# EAGLE design untitled (EAGLE 7.2.0)
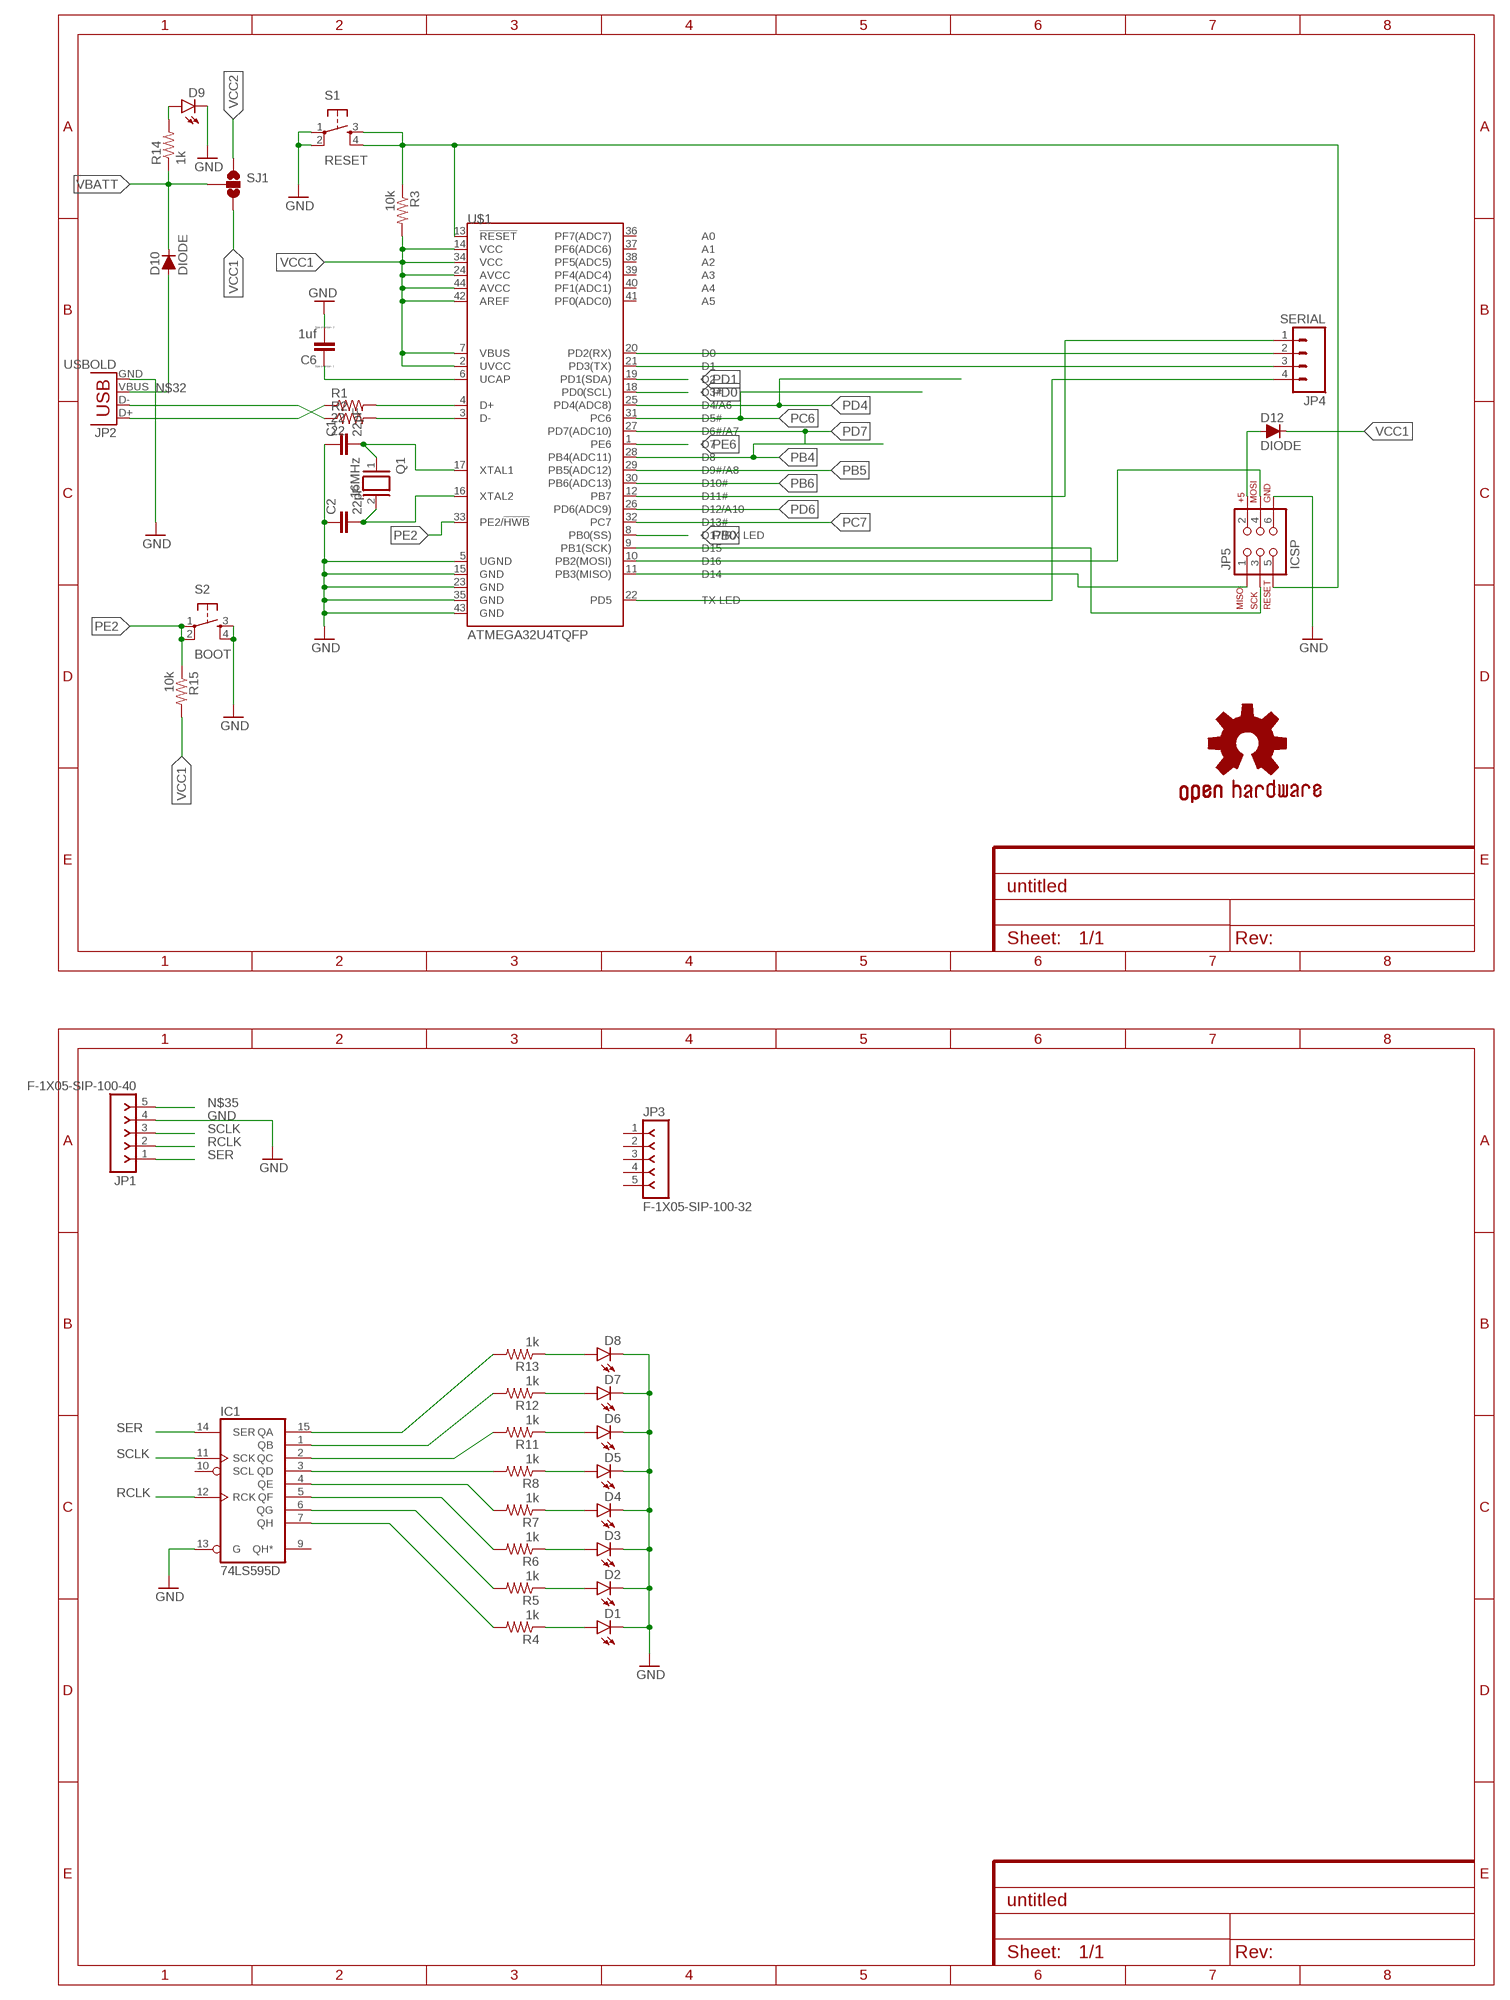
[diagram p0: schematic, sheet 1]
FRAME1 (FRAME-A4L): CNAME: STOcazzo

## Parts
C1  22pF  CAP0603-CAP  [0603-CAP]
C2  22pF  CAP0603-CAP  [0603-CAP]
C6  1uf  CC0603  [C0603]
D1  LED1206  [LED-1206]
D2  LED1206  [LED-1206]
D3  LED1206  [LED-1206]
D4  LED1206  [LED-1206]
D5  LED1206  [LED-1206]
D6  LED1206  [LED-1206]
D7  LED1206  [LED-1206]
D8  LED1206  [LED-1206]
D9  LED1206  [LED-1206]
D10  DIODE  [1206]
D12  DIODE  [1206]
GOLD_ORB_SM1  OSHWLOGO_GOLD_ORB_LG  [OSHW0]
IC1  74LS595D  [SO16]
JP1  F-1X05-SIP-100-40  [SIP-100-05-40]
JP2  USBOLD  [USB-MINIB-OLD]
JP3  F-1X05-SIP-100-32  [SIP-100-05-32]
JP4  SERIAL  M04LOCK_LONGPADS  [1X04_LOCK_LONGPADS]
JP5  ICSP  AVR_SPI_PRG_6PTH  [2X3]
Q1  16MHz  XTAL/S  [QS]
R1  22  RESISTOR0603-RES  [0603-RES]
R2  22  RESISTOR0603-RES  [0603-RES]
R3  10k  RESISTOR0603-RES  [0603-RES]
R4  1k  RESISTOR0603-RES  [0603-RES]
R5  1k  RESISTOR0603-RES  [0603-RES]
R6  1k  RESISTOR0603-RES  [0603-RES]
R7  1k  RESISTOR0603-RES  [0603-RES]
R8  1k  RESISTOR0603-RES  [0603-RES]
R11  1k  RESISTOR0603-RES  [0603-RES]
R12  1k  RESISTOR0603-RES  [0603-RES]
R13  1k  RESISTOR0603-RES  [0603-RES]
R14  1k  RESISTOR1206  [1206]
R15  10k  RESISTOR0603-RES  [0603-RES]
S1  RESET  TAC_SWITCHSMD  [TACTILE-SWITCH-SMD]
S2  BOOT  TAC_SWITCHSMD  [TACTILE-SWITCH-SMD]
SJ1  SOLDERJUMPER_2WAYPASTE2&3  [SJ_3_PASTE2&3]
U$1  ATMEGA32U4TQFP  [SPARKFUN-DIGITALIC_TQFP44]

## Nets
GND: C1.1 C2.1 C6.2 D1.C D2.C D3.C D4.C D5.C D6.C D7.C D8.C D9.C IC1.13(G) JP1.4 JP2.GND JP5.6 S1.1 S1.2 S2.3 S2.4 U$1.5(UGND) U$1.15(GND) U$1.23(GND) U$1.35(GND) U$1.43(GND)
N$1: IC1.15(QA) R13.2
N$2: D1.A R4.1
N$3: JP2.D- R2.1
N$4: JP2.D+ R1.1
N$5: R1.2 U$1.4(D+)
N$6: R2.2 U$1.3(D-)
N$7: D2.A R5.1
N$8: D3.A R6.1
N$9: D4.A R7.1
N$10: D5.A R8.1
N$11: JP5.1 U$1.11(PB3(MISO))
N$12: JP5.3 U$1.9(PB1(SCK))
N$13: JP5.4 U$1.10(PB2(MOSI))
N$14: D6.A R11.1
N$15: D7.A R12.1
N$16: C1.2 Q1.1 U$1.17(XTAL1)
N$17: JP5.5 R3.1 S1.3 S1.4 U$1.13(!RESET)
N$18: D9.A R14.2
N$19: C2.2 Q1.2 U$1.16(XTAL2)
N$20: D8.A R13.1
N$21: IC1.1(QB) R12.2
N$22: IC1.2(QC) R11.2
N$23: C6.1 U$1.6(UCAP)
N$24: JP4.4 U$1.22(PD5)
N$25: IC1.3(QD) R8.2
N$26: IC1.4(QE) R7.2
N$27: IC1.5(QF) R6.2
N$28: IC1.6(QG) R5.2
N$29: JP4.2 U$1.20(PD2(RX))
N$30: JP4.3 U$1.21(PD3(TX))
N$32: D10.P$1(A) JP2.VBUS
N$33: IC1.7(QH) R4.2
N$34: D12.P$1(A) JP5.2
N$35: JP1.5
PB0: U$1.8(PB0(SS))
PB4: U$1.28(PB4(ADC11))
PB5: U$1.29(PB5(ADC12))
PB6: U$1.30(PB6(ADC13))
PB7: JP4.1 U$1.12(PB7)
PC6: U$1.31(PC6)
PC7: U$1.32(PC7)
PD0: U$1.18(PD0(SCL))
PD1: U$1.19(PD1(SDA))
PD4: U$1.25(PD4(ADC8))
PD6: U$1.26(PD6(ADC9))
PD7: U$1.27(PD7(ADC10))
PE2: R15.1 S2.1 S2.2 U$1.33(PE2/!HWB)
PE6: U$1.1(PE6)
RCLK: IC1.12(RCK) JP1.2
SCLK: IC1.11(SCK) JP1.3
SER: IC1.14(SER) JP1.1
VBATT: D10.P$2(C) R14.1 SJ1.2
VCC1: D12.P$2(C) R3.2 R15.2 SJ1.3 U$1.2(UVCC) U$1.7(VBUS) U$1.14(VCC) U$1.24(AVCC) U$1.34(VCC) U$1.42(AREF) U$1.44(AVCC)
VCC2: SJ1.1
Unconnected: IC1.9(QH*) IC1.10(SCL) JP3.1 JP3.2 JP3.3 JP3.4 JP3.5 U$1.36(PF7(ADC7)) U$1.37(PF6(ADC6)) U$1.38(PF5(ADC5)) U$1.39(PF4(ADC4)) U$1.40(PF1(ADC1)) U$1.41(PF0(ADC0))

## Power pins joined to a net without a drawn wire
GND: IC1.8(GND)
VCC: IC1.16(VCC)

## Library data of the parts
C1 C2 = SparkFun-Capacitors:CAP: Capacitor Standard 0603 ceramic capacitor, and 0.1" leaded capacitor.
C6 = eagle-ltspice:C: CAPACITOR, European symbol; SPICEMODEL: NONE; SPICEPREFIX: C
D1-D9 = SparkFun-LED:LED: LEDs Standard schematic elements and footprints for 5mm, 3mm, 1206, and 0603 sized LEDs. 5mm - Spark Fun Electronics SKU : COM-00529 (and others)
D10 D12 = gipi:DIODE: http://docs-europe.electrocomponents.com/webdocs/1189/0900766b811897a9.pdf
GOLD_ORB_SM1 = bfl:OSHWLOGO: These are Open-Source Hardware logos.
IC1 = 74xx-us:74*595: 8-bit SHIFT REGISTER, output latch
JP1 JP3 = con-headers-jp:F-1X05-: FEMALE HEADER
JP2 = SparkFun-Connectors:USB: USB Connectors USB-B-PTH is fully proven SKU : PRT-00139/CONN-08278 USB-miniB is fully proven SKU : PRT-00587 USB-A-PCB is untested. USB-A-H is throughly reviewed, but untested. Spark Fun Electronics SKU : PRT-00437 USB-B-SMT is throughly reviewed, but untested. Needs silkscreen touching up. USB-A-S has not been used/tested USB-MB-H has not been used/tested USB-MICROB has been used. CONN-09505
JP4 = SparkFun-Connectors:M04: Header 4 Standard 4-pin 0.1" header. Use with straight break away headers (SKU : PRT-00116), right angle break away headers (PRT-00553), swiss pins (PRT-00743), machine pins (PRT-00117), and female headers (PRT-00115). Molex polarized connector foot print use with SKU : PRT-08231 with associated crimp pins and housings. 1MM SMD Version SKU: PRT-10208
JP5 = SparkFun-Connectors:AVR_SPI_PRG_6: AVR ISP 6 Pin This is the reduced ISP connector for AVR programming. Common on Arduino. This footprint will take up less PCB space and can be used with a 10-pin to 6-pin adapter such as SKU: BOB-08508 **Special note about "TEST_POINT" package. The stop mask is on the top side, so if you want your programming test points to be on the bottom of your board, make sure to place this package on the bottom side of the board. This also ensure that the orientation to program from the bottom side will be correct.
Q1 = special:XTAL/S: CRYSTAL
R1-R8 R11-R15 = SparkFun-Passives:RESISTOR: Resistor Basic schematic elements and footprints for 0603, 1206, and PTH resistors.
S1 S2 = SparkFun-Retired:TAC_SWITCH: Momentary Switch Button commonly used for reset or general input. Spark Fun Electronics SKU : COM-00097 SMT- SWCH-08247; PROD_ID: SWCH-08247; VALUE: TAC_SWITCHSMD
SJ1 = SparkFun-Retired:SOLDERJUMPER_2WAY: Solder Jumper 2 way solder jumper
U$1 = SparkFun-Retired:ATMEGA32U4: Atmel 44-pin 8-bit Microcontroller with 32KBytes of ISP Flash and USB Controller ----- Please use the QFN-44-NOPAD_1:1 package for the footprint of all boards using a 32U4. Route traces directly away from the pads as much as possible.; PROD_ID: IC-11161

## Board
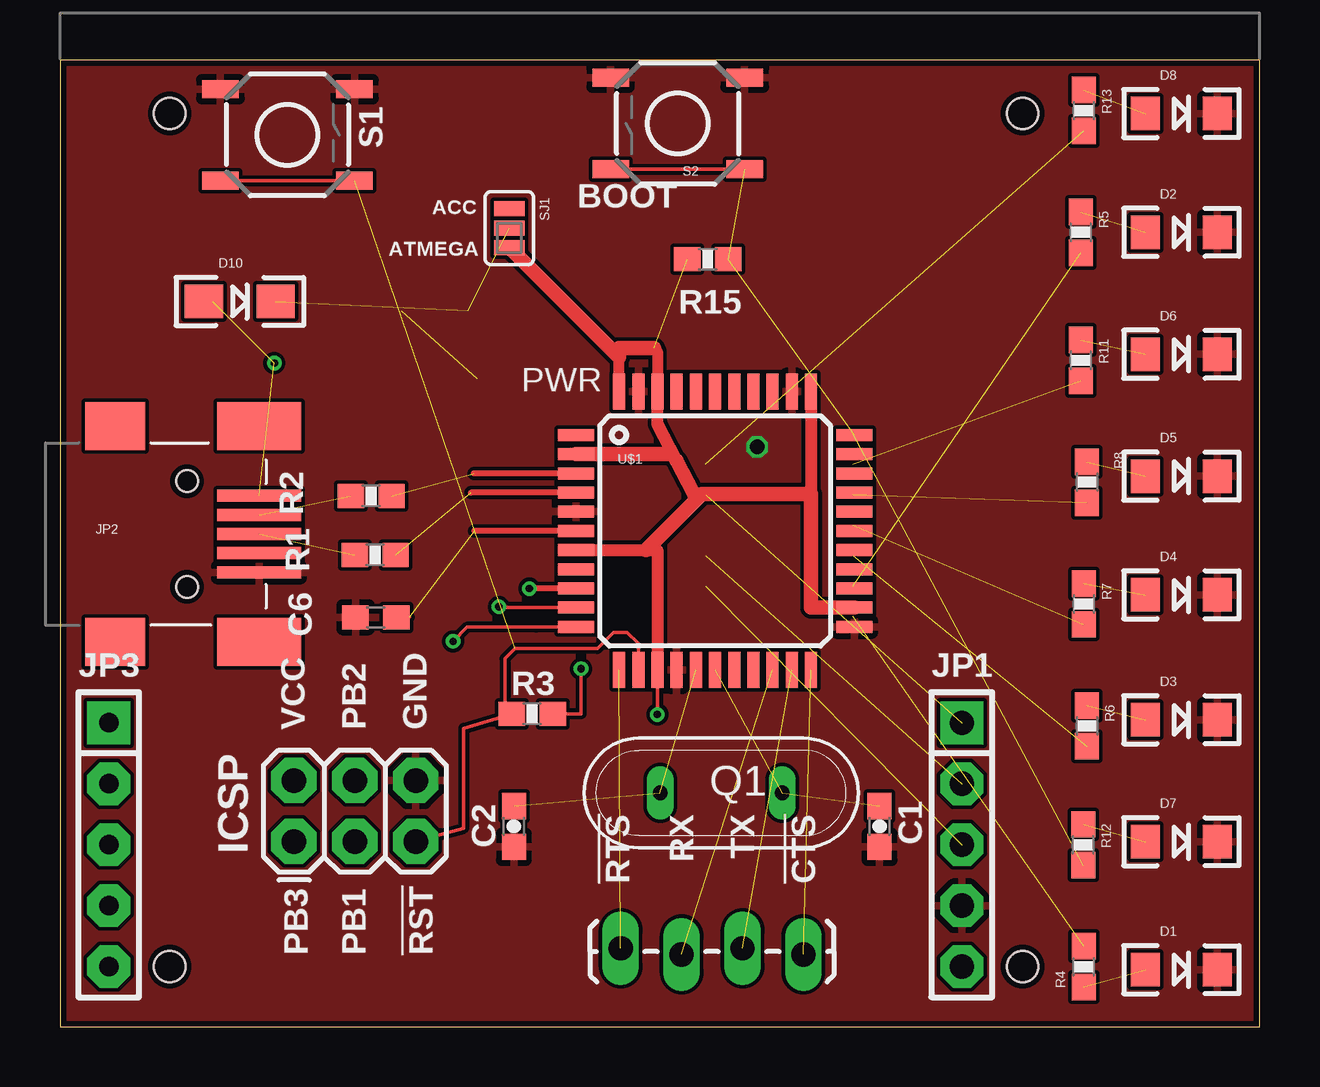
[diagram p1: board, top side]
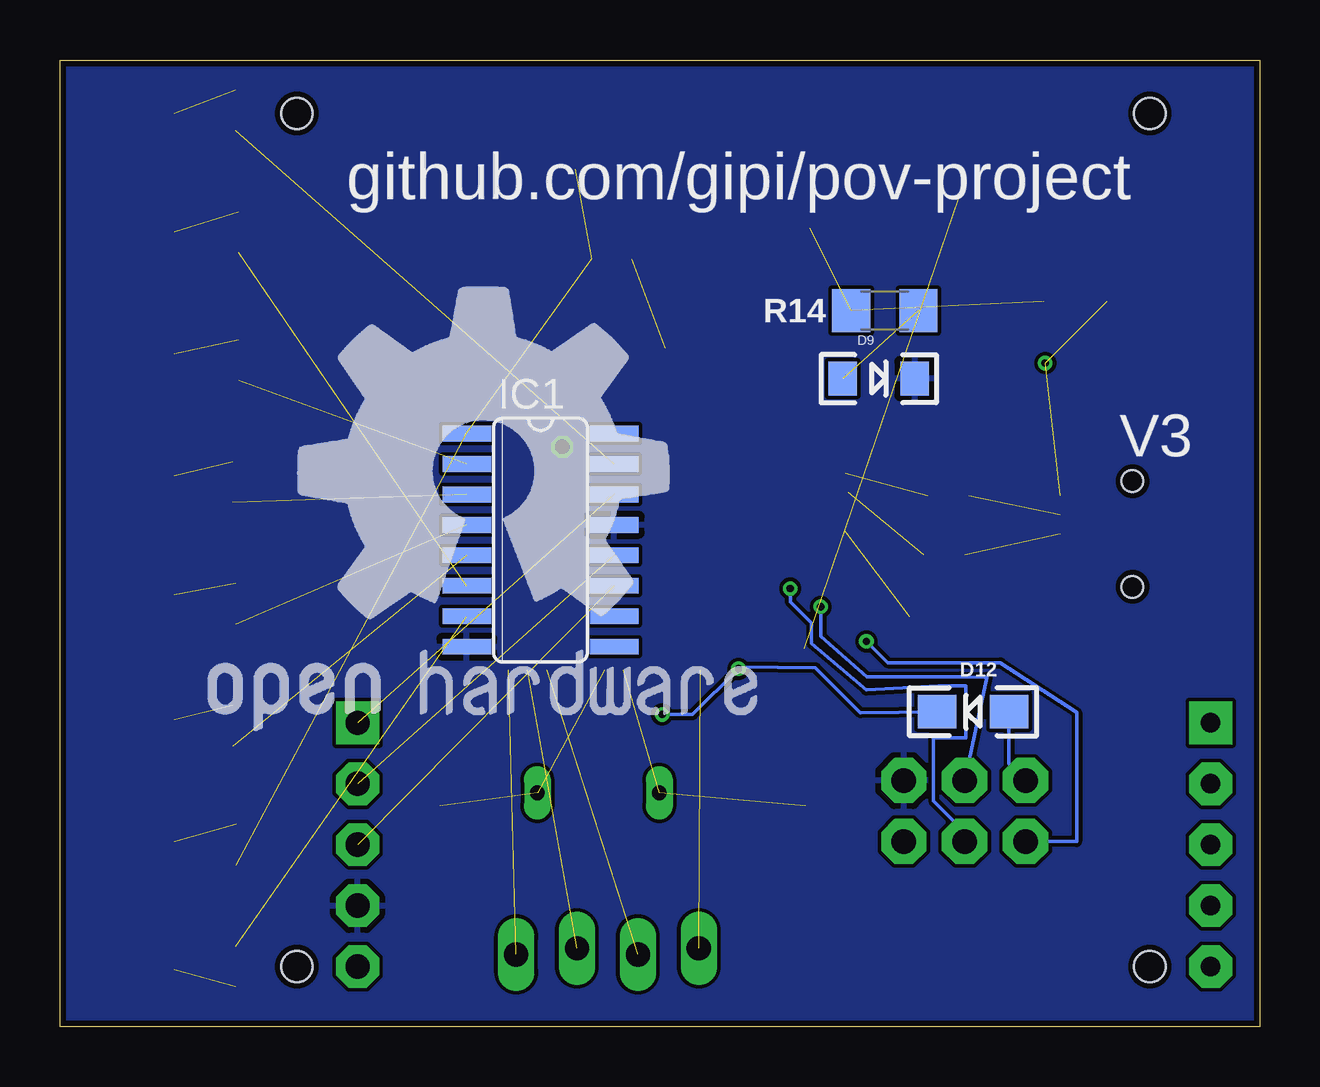
[diagram p2: board, bottom side, seen from below]

Size 50 x 40.31 mm. Coordinates in mm from the lower left corner, seen from the top.
Outline: 0,0 50,0 50,40.31 0,40.31 0,0
Copper layers (1*16): Top 0.035mm / dielectric 1.5mm / Bottom 0.035mm
Design rules "SeeedStudio_2layer_DRU_no_angle_20140221": minimum track width 6mil, minimum drill 12mil, track to track 6mil, track to pad 6mil, pad to pad 6mil, via to via 6mil, smd to smd 0mil, copper to edge 10mil, drill to drill 10mil, minimum pad ring 10mil, minimum via ring 6mil, stop-mask expansion 2mil, vias tented up to drill 100mil, thermal gap 10mil
Holes 1.3 mm at 40.13,38.07 4.57,38.07 4.57,2.51 40.13,2.51

### Footprints (pad centres in the part's own frame; a part is rotated, then mirrored left to right if it is on the bottom)
0603-CAP = smd 1.1 x 1: 1 -0.85,0; 2 0.85,0
C0603 = smd 1.1 x 1: 1 -0.85,0; 2 0.85,0
LED-1206 = smd 1.2 x 1.4: A -1.5,0; C 1.5,0
1206 = smd 1.6 x 1.397: P$1 -1.499,0; P$2 1.499,0
SO16 = smd 0.66 x 2.032: 1 -4.445,-3.073; 2 -3.175,-3.073; 3 -1.905,-3.073; 4 -0.635,-3.073; 5 0.635,-3.073; 6 1.905,-3.073; 7 3.175,-3.073; 8 4.445,-3.073; 9 4.445,3.073; 10 3.175,3.073; 11 1.905,3.073; 12 0.635,3.073; 13 -0.635,3.073; 14 -1.905,3.073; 15 -3.175,3.073; 16 -4.445,3.073
SIP-100-05-40 = drill 1.016 pad 1.778 square: 1 -5.08,0 | drill 1.016 pad 1.778 octagon: 2 -2.54,0; 3 0,0; 4 2.54,0; 5 5.08,0
USB-MINIB-OLD = smd 2.5 x 2: 1 -3,-4.5; 2 -3,4.5 | smd 3.5 x 2: 3 3,-4.5; 4 3,4.5 | smd 3.5 x 0.5: D+ 3,0; D- 3,0.8; GND 3,-1.6; ID 3,-0.8; VBUS 3.01,1.61 | hole 0.9: 0,2.2; 0,-2.2
SIP-100-05-32 = drill 0.813 pad 1.778 square: 1 -5.08,0 | drill 0.813 pad 1.778 octagon: 2 -2.54,0; 3 0,0; 4 2.54,0; 5 5.08,0
1X04_LOCK_LONGPADS = drill 1.016 long: 1 0,0; 2 2.54,-0.254; 3 5.08,0; 4 7.62,-0.254
2X3 = drill 1.016 pad 1.88 octagon: 1 0,0; 2 0,2.54; 3 2.54,0; 4 2.54,2.54; 5 5.08,0; 6 5.08,2.54
QS = drill 0.61 long: 1 -2.54,0; 2 2.54,0
0603-RES = smd 1.1 x 1: 1 -0.85,0; 2 0.85,0
1206' = smd 1.6 x 1.8: 1 -1.4,0; 2 1.4,0
TACTILE-SWITCH-SMD = smd 1.524 x 0.762: 1 -2.794,1.905; 2 2.794,1.905; 3 -2.794,-1.905; 4 2.794,-1.905
SJ_3_PASTE2&3 = smd 0.635 x 1.27: 1 -0.813,0; 2 0,0; 3 0.813,0
SPARKFUN-DIGITALIC_TQFP44 = smd 1.5 x 0.5: 1 -5.8,4; 2 -5.8,3.2; 3 -5.8,2.4; 4 -5.8,1.6; 5 -5.8,0.8; 6 -5.8,0; 7 -5.8,-0.8; 8 -5.8,-1.6; 9 -5.8,-2.4; 10 -5.8,-3.2; 11 -5.8,-4; 23 5.8,-4; 24 5.8,-3.2; 25 5.8,-2.4; 26 5.8,-1.6; 27 5.8,-0.8; 28 5.8,0; 29 5.8,0.8; 30 5.8,1.6; 31 5.8,2.4; 32 5.8,3.2; 33 5.8,4 | smd 0.5 x 1.5: 12 -4,-5.8; 13 -3.2,-5.8; 14 -2.4,-5.8; 15 -1.6,-5.8; 16 -0.8,-5.8; 17 0,-5.8; 18 0.8,-5.8; 19 1.6,-5.8; 20 2.4,-5.8; 21 3.2,-5.8; 22 4,-5.8; 34 4,5.8; 35 3.2,5.8; 36 2.4,5.8; 37 1.6,5.8; 38 0.8,5.8; 39 0,5.8; 40 -0.8,5.8; 41 -1.6,5.8; 42 -2.4,5.8; 43 -3.2,5.8; 44 -4,5.8

### Placement (x,y rotation side)
C1  34.16,8.35 90 top
C2  18.92,8.35 90 top
C6  13.17,17.07 180 top
D1  46.74,2.38 0 top
D2  46.74,33.12 0 top
D3  46.74,12.8 0 top
D4  46.74,18.01 0 top
D5  46.74,22.96 0 top
D6  46.74,28.04 0 top
D7  46.74,7.72 0 top
D8  46.74,38.07 0 top
D9  15.88,27.02 0 bottom
D10  7.49,30.24 0 top
D12  11.94,13.14 180 bottom
GOLD_ORB_SM1  45.09,8.9 0 bottom
IC1  29.97,20.29 270 bottom
JP1  37.59,7.59 270 top
JP2  5.29,20.54 0 top
JP3  2.03,7.59 270 top
JP4  23.37,3.27 0 top
JP5  9.75,7.73 0 top
Q1  27.56,9.75 180 top
R1  13.14,19.67 0 top
R2  12.97,22.13 0 top
R3  19.69,13.05 0 top
R4  42.67,2.51 90 top
R5  42.54,33.12 270 top
R6  42.8,12.54 270 top
R7  42.67,17.62 270 top
R8  42.8,22.71 270 top
R11  42.54,27.79 270 top
R12  42.65,7.59 270 top
R13  42.67,38.2 270 top
R14  1k  [1206']  15.62,29.86 0 bottom
R15  27,32.01 180 top
S1  9.48,37.18 0 top
S2  25.75,37.66 180 top
SJ1  18.73,33.3 270 top
U$1  27.3,20.67 0 top

### Tracks (layer width: path | path; a pad name or v marks a point on that pad's centre or on a via)
GN
  Top 0.152: 47.75,27.61 47.75,27.62
GND  (via drill 0.6)
  other vias: 29.06,24.18
  pour Bottom: -2.54,40.36 55.24,40.36 55.24,-2.19 -2.54,-2.19
  pour Top: -5.08,40.36 52.7,40.36 52.7,-2.19 -5.08,-2.19
N$1  (1 unrouted)
N$2  (1 unrouted)
N$3  (1 unrouted)
  Top 0.406: 8.26,21.31 JP2.D-
N$4  (1 unrouted)
N$5  (1 unrouted)
  Top 0.254: U$1.4 17.13,22.27
N$6  (1 unrouted)
  Top 0.254: U$1.3 17.26,23.07
N$7  (1 unrouted)
N$8  (1 unrouted)
N$9  (1 unrouted)
N$10  (1 unrouted)
N$11  (via drill 0.3)
  Top 0.152: U$1.11 19.87,16.67 19.86,16.66 16.98,16.66 v16.39,16.07
  Bottom 0.152: 10.08,7.73 JP5.1 7.62,7.73 7.62,13.11 10.8,15.18 15.5,15.18 v16.39,16.07
N$12  (via drill 0.3)
  Top 0.152: v19.56,18.27
  Top 0.254: U$1.9 v19.56,18.27
  Bottom 0.152: v19.56,18.27 19.56,17.72 18.67,16.83 18.67,15.99 16.39,14.04 13.38,14.21 12.24,14.21 12.24,12.05 13.59,12.05 13.59,9.42 12.74,8.57 12.74,7.73 JP5.3
N$13  (via drill 0.3)
  Top 0.152: U$1.10 18.29,17.47 v18.29,17.51
  Bottom 0.152: v18.29,17.51 18.29,16.27 16.36,14.59 12.45,14.59 11.36,14.58 JP5.4
N$14  (1 unrouted)
N$15  (1 unrouted)
N$16  (2 unrouted)
N$17  (1 unrouted)
  Top 0.152: S1.3 S1.4 | JP5.5 16.82,8.28 16.82,12.44 R3.1 18.55,13.34 18.55,15.35 18.97,15.77 22.4,15.77 23.08,16.45 23.63,16.45 24.11,15.97 U$1.13
N$18  (1 unrouted)
N$19  (2 unrouted)
N$20  (1 unrouted)
N$21  (1 unrouted)
N$22  (1 unrouted)
N$23  (1 unrouted)
  Top 0.152: 14.57,17.09 C6.1
  Top 0.254: U$1.6 17.28,20.67
N$24  (1 unrouted)
N$25  (1 unrouted)
N$26  (1 unrouted)
N$27  (1 unrouted)
N$28  (1 unrouted)
N$29  (1 unrouted)
N$30  (1 unrouted)
N$32  (via drill 0.3)  (2 unrouted)
  Top 0.406: D10.P$1 6.37,30.24
  other vias: 8.93,27.67
N$33  (1 unrouted)
N$34
  Bottom 0.152: D12.P$1 10.44,10.96 JP5.2
PB7  (1 unrouted)
PE2  (2 unrouted)
  Top 0.152: S2.2 S2.1
RCLK  (1 unrouted)
SCLK  (1 unrouted)
SER  (1 unrouted)
VBATT  (2 unrouted)
VCC1  (via drill 0.3)  (1 unrouted)
  Top 0.152: 23.3,27.93 23.3,28.29 | 24.77,26.47 U$1.42 | U$1.14 24.91,13.03 v24.9,13.02 | v21.72,14.93 21.72,13.05 R3.2 | 25.43,23.87 25.69,23.61 | U$1.7 24.42,19.87
  Top 0.305: U$1.42 | 26.76,22.21 26.42,22.21 | SJ1.3 18.75,32.48
  Top 0.406: 24.77,28.29 24.91,28.15
  Top 0.457: U$1.44 23.3,27.93 | 24.91,28.15 U$1.42
  Top 0.508: U$1.42 24.9,25.13 25.69,23.61 | U$1.34 31.3,22.21 | U$1.7 24.91,19.87 U$1.14
  Top 0.61: 23.3,28.29 24.77,28.29 | 26.42,22.21 25.69,23.61 | 18.75,32.48 23.3,27.93 | U$1.2 25.43,23.87 | 24.42,19.87 26.76,22.21 31.3,22.21 31.3,17.47 U$1.24
  Bottom 0.152: v24.9,13.02 23.63,13.02 v21.72,14.93 21.64,15.01 18.5,14.97 16.63,13.09 D12.P$2

### Text on the board
tPlace: ACC | BOOT | ATMEGA | PWR | VCC | PB2 | GND | !RTS | RX | TX | !CTS | PB3 | PB1 | !RST
bPlace: github.com/gipi/pov-project | V3